# Altium schematic sheet Microcontroller.SchDoc
size A4
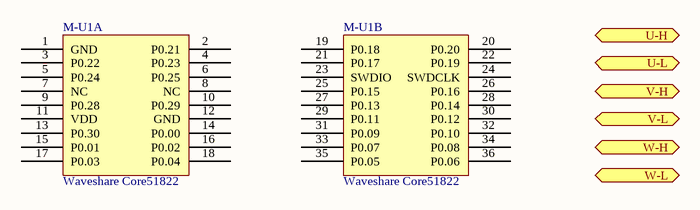
[diagram p0: Microcontroller.SchDoc]

## Parts
M-U1  Waveshare Core51822  [Core51822]  (parts A,B of 2)

## Ports
U-H (out), U-L (out), V-H (out), V-L (out), W-H (out), W-L (out)

## Nets

Not connected (* = marked no-connect by the designer): M-U1 1(GND) 2(P0.21) 3(P0.22) 4(P0.23) 5(P0.24) 6(P0.25) 7(NC) 8(NC) 9(P0.28) 10(P0.29) 11(VDD) 12(GND) 13(P0.30) 14(P0.00) 15(P0.01) 16(P0.02) 17(P0.03) 18(P0.04) 19(P0.18) 20(P0.20) 21(P0.17) 22(P0.19) 23(SWDIO) 24(SWDCLK) 25(P0.15) 26(P0.16) 27(P0.13) 28(P0.14) 29(P0.11) 30(P0.12) 31(P0.09) 32(P0.10) 33(P0.07) 34(P0.08) 35(P0.05) 36(P0.06)

## Library data of the parts
M-U1 = Core51822_2